# Altium project Multi_HUTSCHIENE_EXT_1_1.PrjPcb
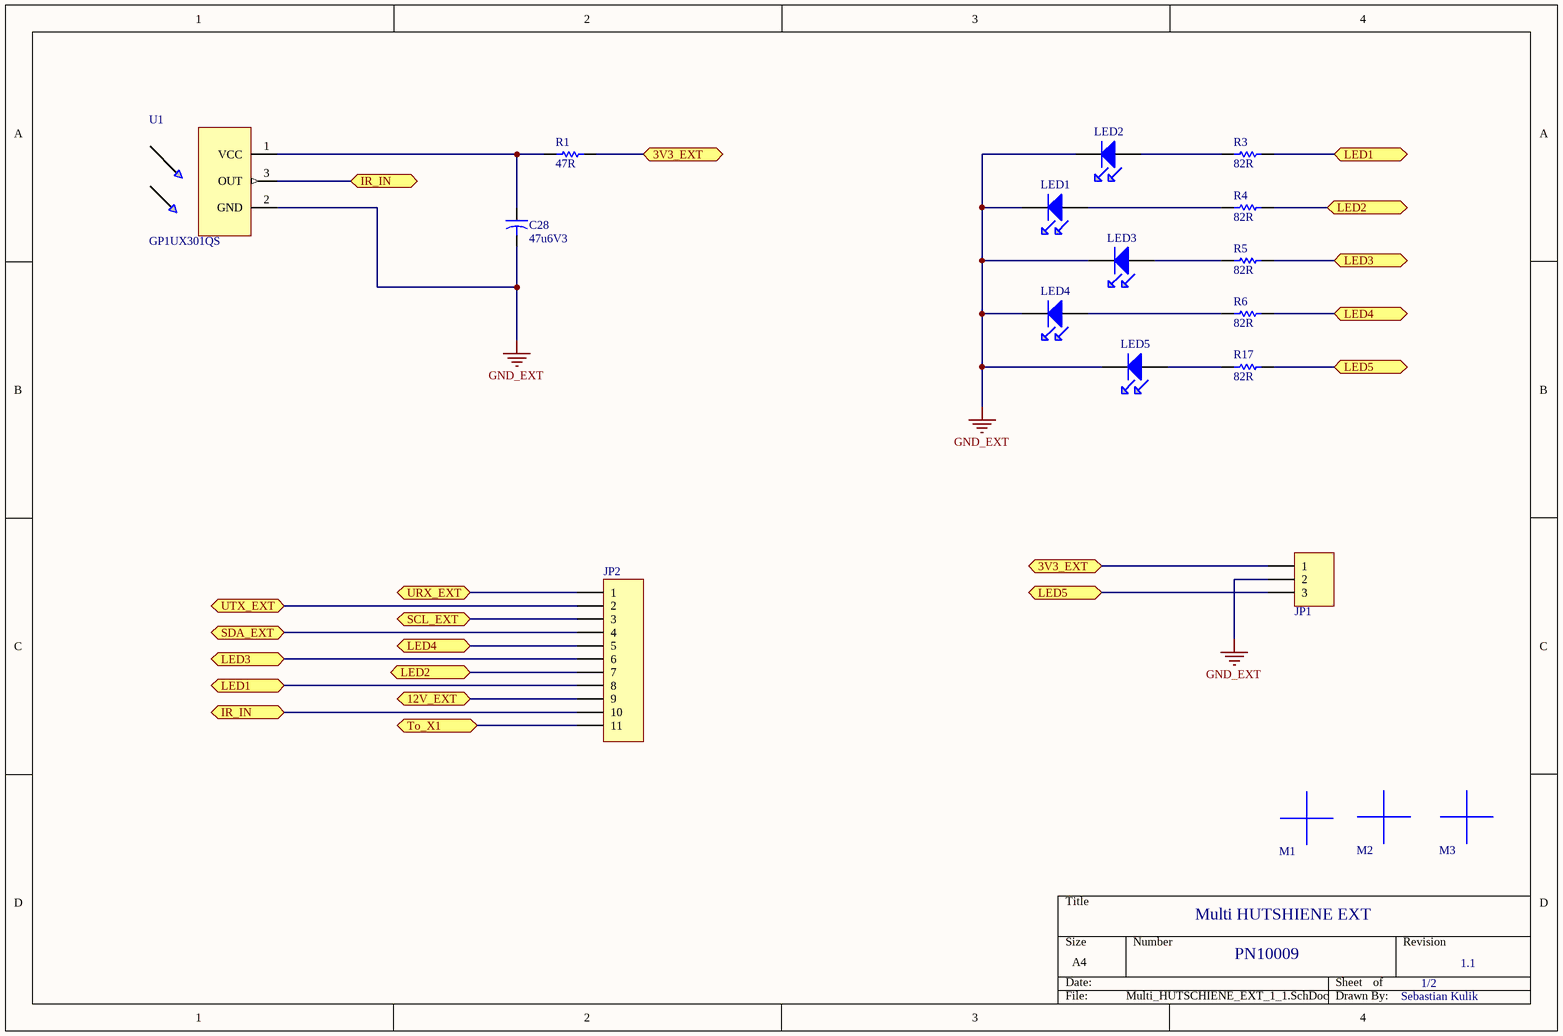
[diagram p0: Multi_HUTSCHIENE_EXT_1_1.SchDoc]
2 sheets, 28 parts. Net scope: flat (ports and power ports of the same name join across sheets).
Board file: Multi_HUTSCHIENE_EXT_1_1.PcbDoc
Sheets:
  Multi_HUTSCHIENE_EXT_1_1.SchDoc
  Multi_HUTSCHIENE_EXT_1_2.SchDoc

## Sheet Multi_HUTSCHIENE_EXT_1_1.SchDoc
size A4

### Parts
C28  value 47u6V3  [C0805]  (hidden comment: 47u6V3_0805)
JP1  Plug_3_90_2.54  [HDR1X3-DOWN]  (value not drawn)
JP2  Plug_11_90_2.54  [HDR1X11_2.54-DOWN]  (value not drawn)
LED1  HSMG-120-Y  [HSMA-120-OR]  (value not drawn)
LED2  HSMG-120-GR  [HSMA-120-G]  (value not drawn)
LED3  HSMG-120-Y  [HSMA-120-OR]  (value not drawn)
LED4  HSMG-120-Y  [HSMA-120-OR]  (value not drawn)
LED5  HSMG-120-Y  [HSMA-120-OR]  (value not drawn)
M1  Mark  [Mark-3mm]  (value not drawn)
M2  Mark  [Mark-3mm]  (value not drawn)
M3  Mark  [Mark-3mm]  (value not drawn)
R1  value 47R  [R0603(1608)]  (hidden comment: 47R_0603)
R3  value 82R  [R0603(1608)]  (hidden comment: 82R_0603)
R4  value 82R  [R0603(1608)]  (hidden comment: 82R_0603)
R5  value 82R  [R0603(1608)]  (hidden comment: 82R_0603)
R6  value 82R  [R0603(1608)]  (hidden comment: 82R_0603)
R17  value 82R  [R0603(1608)]  (hidden comment: 82R_0603)
U1  GP1UX301QS  [IR-GP]

### Ports
3V3_EXT, 12V_EXT, IR_IN, LED1, LED2, LED3, LED4, LED5, SCL_EXT, SDA_EXT, To_X1, URX_EXT, UTX_EXT

### Nets
GND_EXT: C28.2 JP1.2 LED1.1(K) LED2.1(K) LED3.1(K) LED4.1(K) LED5.1(K) U1.2(GND)
NetC12_1: JP1.1 R1.2 ; port 3V3_EXT
NetC28_1: C28.1 R1.1 U1.1(VCC)
NetJP1_3: JP1.3 R17.2 ; port LED5
NetJP2_1: JP2.1 ; port URX_EXT
NetJP2_2: JP2.2 ; port UTX_EXT
NetJP2_3: JP2.3 ; port SCL_EXT
NetJP2_4: JP2.4 ; port SDA_EXT
NetJP2_5: JP2.5 R6.2 ; port LED4
NetJP2_6: JP2.6 R5.2 ; port LED3
NetJP2_7: JP2.7 R4.2 ; port LED2
NetJP2_8: JP2.8 R3.2 ; port LED1
NetJP2_9: JP2.9 ; port 12V_EXT
NetJP2_10: JP2.10 U1.3(OUT) ; port IR_IN
NetJP2_11: JP2.11 ; port To_X1
NetLED1_2: LED1.2(A) R4.1
NetLED2_2: LED2.2(A) R3.1
NetLED3_2: LED3.2(A) R5.1
NetLED4_2: LED4.2(A) R6.1
NetLED5_2: LED5.2(A) R17.1

### Notes on the sheet
- Multi HUTSHIENE EXT
- PN10009
- 1/2
- 1.1
- Sebastian Kulik

### Library data of the parts
C28 = 47u6V3_0805: Kemet  C series, X5R, 20%, 6.3V; Deliverer PartNr: 1572633RL; Manufacturer PartNr: C0805C476M9PACTU; Deliverer: Farnell; TDFE-PN: C0040; Published: 18.02.2014; Part Description: Kemet  C series, X5R, 20%, 6.3V; Publisher: Sebastian Kulik; PackageDescription: C0805; Manufacturer: Kemet
JP1 = Plug_3_90_2.54: Plug,-3-Pin; Manufacturer: WE; Manufacturer PartNr: 61300311021; Deliverer PartNr: 2356177; Deliverer: Farnell; TDE-PN: CON0011; Publisher: Sebastian Kulik
JP2 = Plug_11_90_2.54: Plug, 11-Pin; Manufacturer PartNr: HTSW-111-08-T-S-RA; Manufacturer: Semtec; Deliverer PartNr: 2009889; Deliverer: Farnell; TDE-PN: CON0009; LatestRevisionDate: 14.05.2014; LatestRevisionNote: Re-released for DXP Platform.; Publisher: Sebastian Kulik
LED1 LED3-LED5 = HSMG-120-Y: LED, 90°, yellow; Manufacturer PartNr: HSMG-C120; Deliverer PartNr: 1058355; Manufacturer: Avago; TDE-PN: DIS0012; Deliverer: Farnell; Published: 18.02.2014; PackageReference: HSMA120Y; Publisher: Sebastian Kulik; PackageDescription: HSMA120Y
LED2 = HSMG-120-GR: LED, 90°, green; Manufacturer PartNr: HSMG-C120; Deliverer PartNr: 1058364; Manufacturer: Avago; TDE-PN: DIS0011; Deliverer: Farnell; Published: 18.02.2014; PackageReference: HSMA120G; Publisher: Sebastian Kulik; PackageDescription: HSMA120G
R1 = 47R_0603: Vishay, CRCW series, 100mW, 1%; Manufacturer PartNr: CRCW060347R0FKEA; Deliverer PartNr: 2122502; TDE-PN: R0039; Deliverer: Farnell; Published: 18.02.2014; Publisher: Sebastian Kulik; PackageDescription: 0603; Manufacturer: Vishay; Part Desicription: Vishay, CRCW series, 100mW, 1%
R3-R6 R17 = 82R_0603: Vishay, CRCW series, 100mW, 1%; Manufacturer PartNr: CRCW060382R0FKEA; Deliverer PartNr: 2122228; TDE-PN: R0040; Deliverer: Farnell; Published: 18.02.2014; Publisher: Sebastian Kulik; PackageDescription: 0603; Manufacturer: Vishay; Part Desicription: Vishay, CRCW series, 100mW, 1%
U1 = GP1UX301QS: IR reseiver; Deliverer PartNr: 1243866; Manufacturer: Sharp; Deliverer: Farnell; TDE-PN: IC0039; Published: 17.02.2014; PackageReference: IR-GP; Publisher: Sebastian Kulik; Manufacturer PartNr: GP1UX301QS

## Sheet Multi_HUTSCHIENE_EXT_1_2.SchDoc
size A4
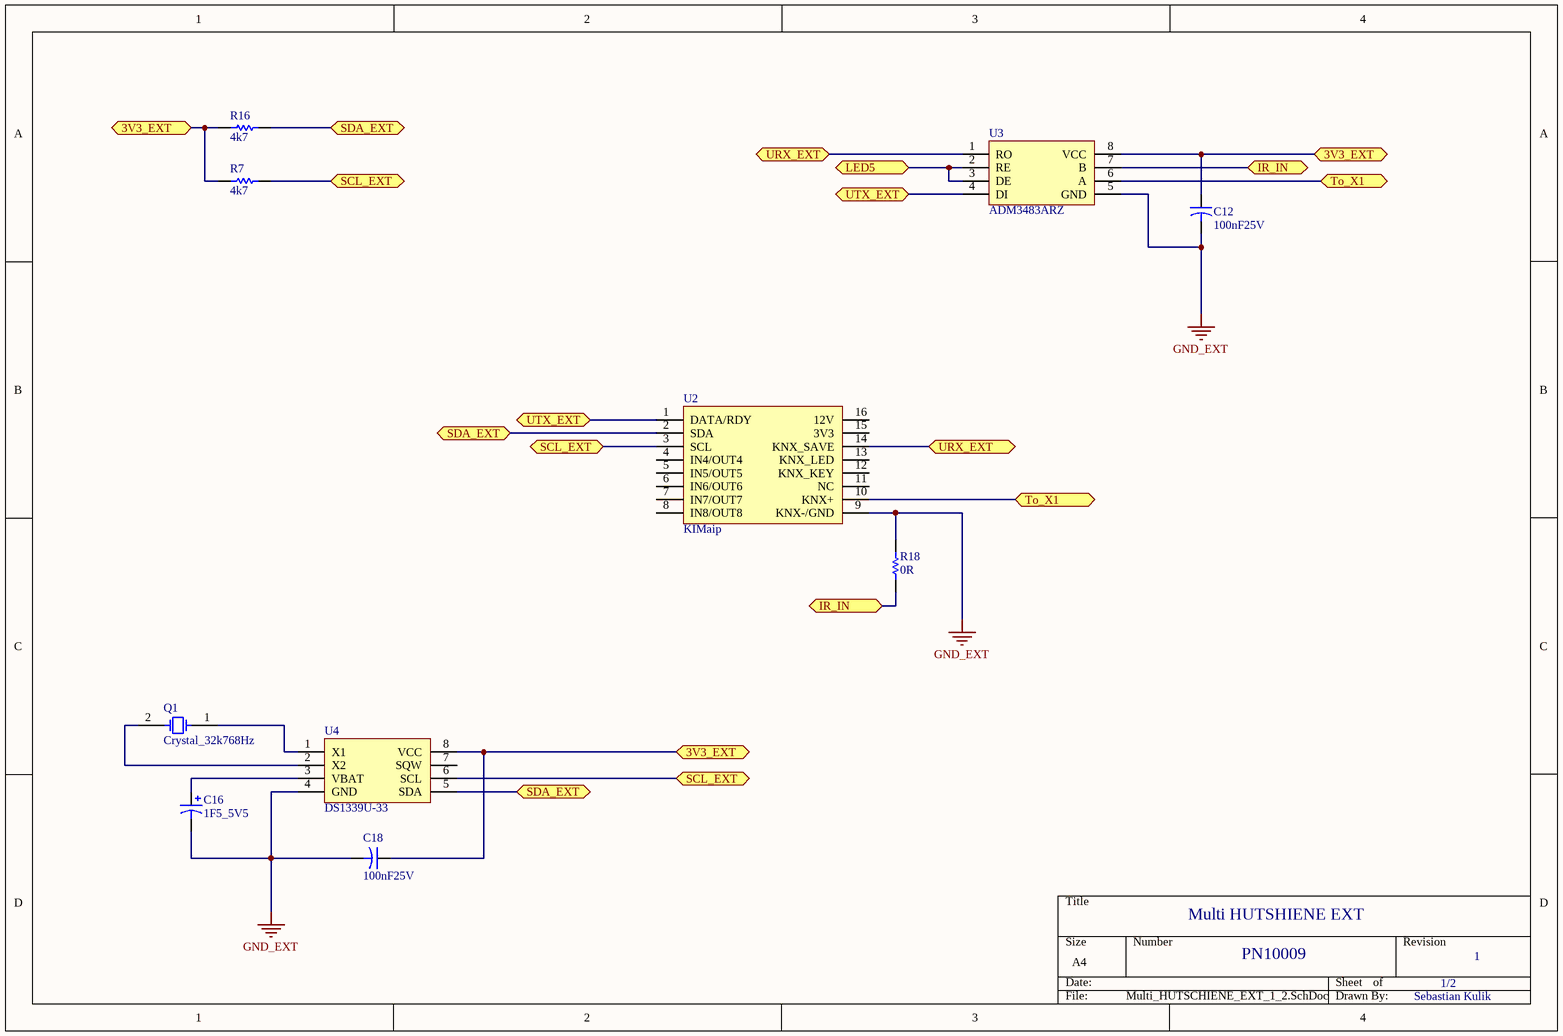
[diagram p1: Multi_HUTSCHIENE_EXT_1_2.SchDoc]

### Parts
C12  value 100nF25V  [C0402]  (hidden comment: 100nF25V_0402)
C16  value 1F5_5V5  [Goldcap_B]  (hidden comment: 1F5_5V5_POL)
C18  value 100nF25V  [C0402]  (hidden comment: 100nF25V_0402)
Q1  Crystal_32k768Hz  [VT-200]
R7  value 4k7  [R0402]  (hidden comment: 4k7_0402)
R16  value 4k7  [R0402]  (hidden comment: 4k7_0402)
R18  value 0R  [R0603(1608)]  (hidden comment: 0R_0603)
U2  KIMaip  [KIMaip]
U3  ADM3483ARZ  [SOIC8_N]
U4  DS1339U-33  [uSOP8]

### Ports
3V3_EXT, IR_IN, LED5, SCL_EXT, SDA_EXT, To_X1, URX_EXT, UTX_EXT

### Nets
GND_EXT: C12.2 C16.2 C18.2 R18.2 U2.9(KNX-/GND) U3.5(GND) U4.4(GND)
NetC12_1: C12.1 C18.1 R7.1 R16.1 U3.8(VCC) U4.8(VCC) ; port 3V3_EXT
NetC16_1: C16.1 U4.3(VBAT)
NetJP1_3: U3.2(RE) U3.3(DE) ; port LED5
NetJP2_1: U2.14(KNX_SAVE) U3.1(RO) ; port URX_EXT
NetJP2_2: U2.1(DATA/RDY) U3.4(DI) ; port UTX_EXT
NetJP2_3: R7.2 U2.3(SCL) U4.6(SCL) ; port SCL_EXT
NetJP2_4: R16.2 U2.2(SDA) U4.5(SDA) ; port SDA_EXT
NetJP2_10: R18.1 U3.7(B) ; port IR_IN
NetJP2_11: U2.10(KNX+) U3.6(A) ; port To_X1
NetQ1_1: Q1.1(E/D) U4.1(X1)
NetQ1_2: Q1.2(GND) U4.2(X2)

Not connected (* = marked no-connect by the designer): U2 4(IN4/OUT4) 5(IN5/OUT5) 6(IN6/OUT6) 7(IN7/OUT7) 8(IN8/OUT8) 11(NC) 12(KNX_KEY) 13(KNX_LED) 15(3V3) 16(12V); U4 7(SQW)

### Notes on the sheet
- Multi HUTSHIENE EXT
- PN10009
- 1/2
- 1
- Sebastian Kulik

### Library data of the parts
C12 C18 = 100nF25V_0402: AVX, X5R, 10%, 25V; Deliverer PartNr: 2280767; Manufacturer PartNr: 04023D104KAT2A; Deliverer: Farnell; TDFE-PN: C0036; Published: 13.02.2014; Part Description: AVX, X5R, 10%, 25V; Publisher: Sebastian Kulik; PackageDescription: C0403; Manufacturer: AVX
C16 = 1F5_5V5_POL: Panasonic, F series; Deliverer PartNr: 1305065; Manufacturer PartNr: EECF5R5U155; Deliverer: Farnell; TDFE-PN: C0042; Published: 26.02.2014; Part Description: Panasonic, F series; Publisher: Sebastian Kulik; PackageDescription: Goldcap-B; Manufacturer: Panasonic
Q1 = Crystal_32k768Hz: Crystal, 32.768kHz; Deliverer PartNr: 1607117; Manufacturer PartNr: VT-200-F; Manufacturer: Seiko; Deliverer: Farnell; TDE-PN: P0018; Published: 14.02.2014; PackageReference: VT-200; Publisher: Sebastian Kulik
R7 R16 = 4k7_0402: Vishay CRCW series, 63mW, 1%; Manufacturer PartNr: CRCW04024K70FKED; Deliverer PartNr: 2121688; TDE-PN: R0009; Deliverer: Farnell; Published: 25.02.2014; PackageReference: 0402; Publisher: Sebastian Kulik; PackageDescription: 0402; Manufacturer: Vishay; Part Description: Vishay CRCW series, 63mW, 1%
R18 = 0R_0603: Vishay, CRCW series, 100mW; Manufacturer PartNr: CRCW06030000ZSTA; Deliverer PartNr: 1652824; TDE-PN: R0041; Deliverer: Farnell; Published: 18.02.2014; Publisher: Sebastian Kulik; PackageDescription: 0603; Manufacturer: Vishay; Part Desicription: Vishay, CRCW series, 100mW
U2 = KIMaip: PoE, 12V; Manufacturer: Tapko; TDE-PN: IC0040; Published: 25.02.2014; Deliverer PartNr: -; Deliverer: -; PackageReference: TSSOP8; Publisher: Sebastian Kulik; Manufacturer PartNr: KIMaip
U3 = ADM3483ARZ: Transceiver, RS485/422; Deliverer PartNr: 1274169; Manufacturer: ADI; Deliverer: Farnell; TDE-PN: IC0041; Published: 25.02.2014; PackageReference: TSSOP8; Publisher: Sebastian Kulik; Manufacturer PartNr: ADM3483ARZ
U4 = DS1339U-33: RTC; Deliverer PartNr: 1379717; Manufacturer: Dallas; Deliverer: Farnell; TDE-PN: IC0042; Published: 25.02.2014; PackageReference: TSSOP8; Publisher: Sebastian Kulik; Manufacturer PartNr: DS1339U-33

## Nets that join several sheets
GND_EXT: Multi_HUTSCHIENE_EXT_1_1 (8 pins), Multi_HUTSCHIENE_EXT_1_2 (7 pins)
NetC12_1: Multi_HUTSCHIENE_EXT_1_1 (JP1.1 R1.2), Multi_HUTSCHIENE_EXT_1_2 (6 pins)
NetJP1_3: Multi_HUTSCHIENE_EXT_1_1 (JP1.3 R17.2), Multi_HUTSCHIENE_EXT_1_2 (U3.2 U3.3)
NetJP2_1: Multi_HUTSCHIENE_EXT_1_1 (JP2.1), Multi_HUTSCHIENE_EXT_1_2 (U2.14 U3.1)
NetJP2_2: Multi_HUTSCHIENE_EXT_1_1 (JP2.2), Multi_HUTSCHIENE_EXT_1_2 (U2.1 U3.4)
NetJP2_3: Multi_HUTSCHIENE_EXT_1_1 (JP2.3), Multi_HUTSCHIENE_EXT_1_2 (R7.2 U2.3 U4.6)
NetJP2_4: Multi_HUTSCHIENE_EXT_1_1 (JP2.4), Multi_HUTSCHIENE_EXT_1_2 (R16.2 U2.2 U4.5)
NetJP2_10: Multi_HUTSCHIENE_EXT_1_1 (JP2.10 U1.3), Multi_HUTSCHIENE_EXT_1_2 (R18.1 U3.7)
NetJP2_11: Multi_HUTSCHIENE_EXT_1_1 (JP2.11), Multi_HUTSCHIENE_EXT_1_2 (U2.10 U3.6)

## Assembly variants
EIB-GW: not fitted C12 C16 C18 Q1 U1 U3 U4
Multisensor: not fitted C16 C18 Q1 R7 R16 R18 U1 U2 U4
WS: not fitted C12 R18 U1 U2 U3
MMC: not fitted C12 C16 C18 Q1 R7 R16 R18 U2 U3 U4
DIM4: not fitted C12 C16 C18 C28 Q1 R1 R7 R16 R18 U1 U2 U3 U4